# EasyEDA Pro project Luthers-VCO.eprj

# Board Top
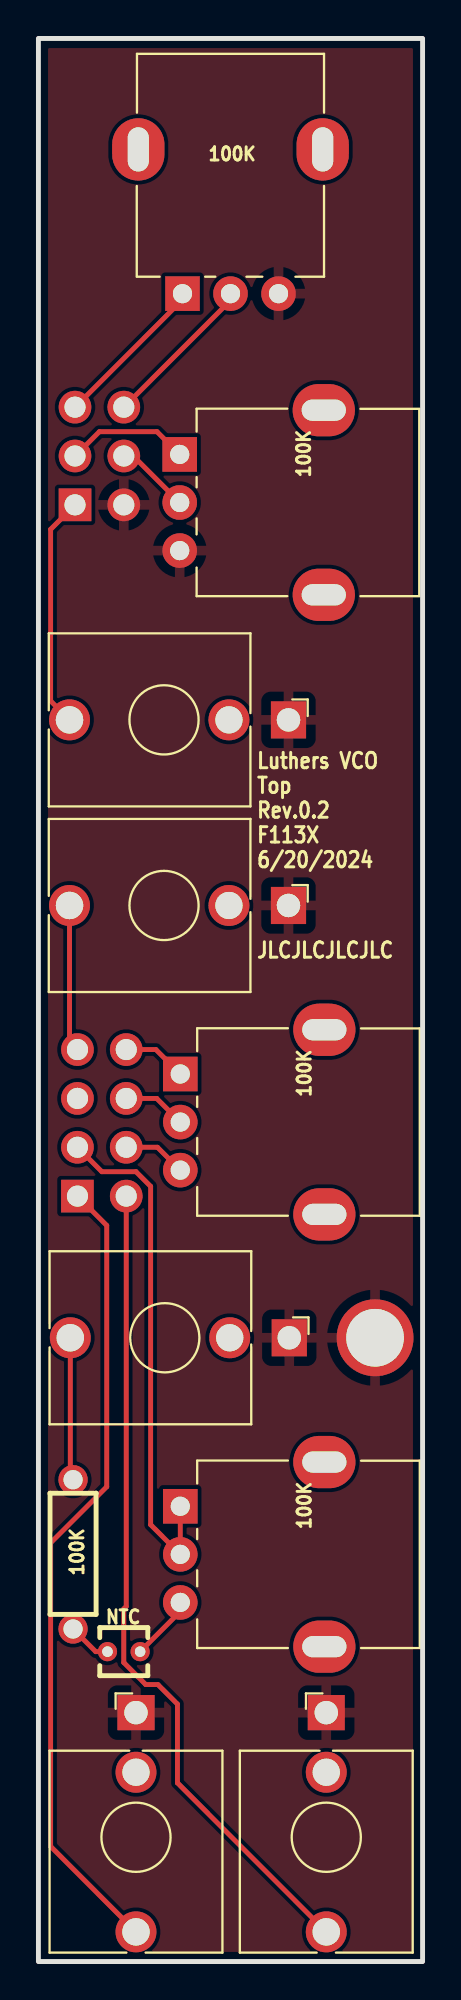
[diagram p0: board, top side]
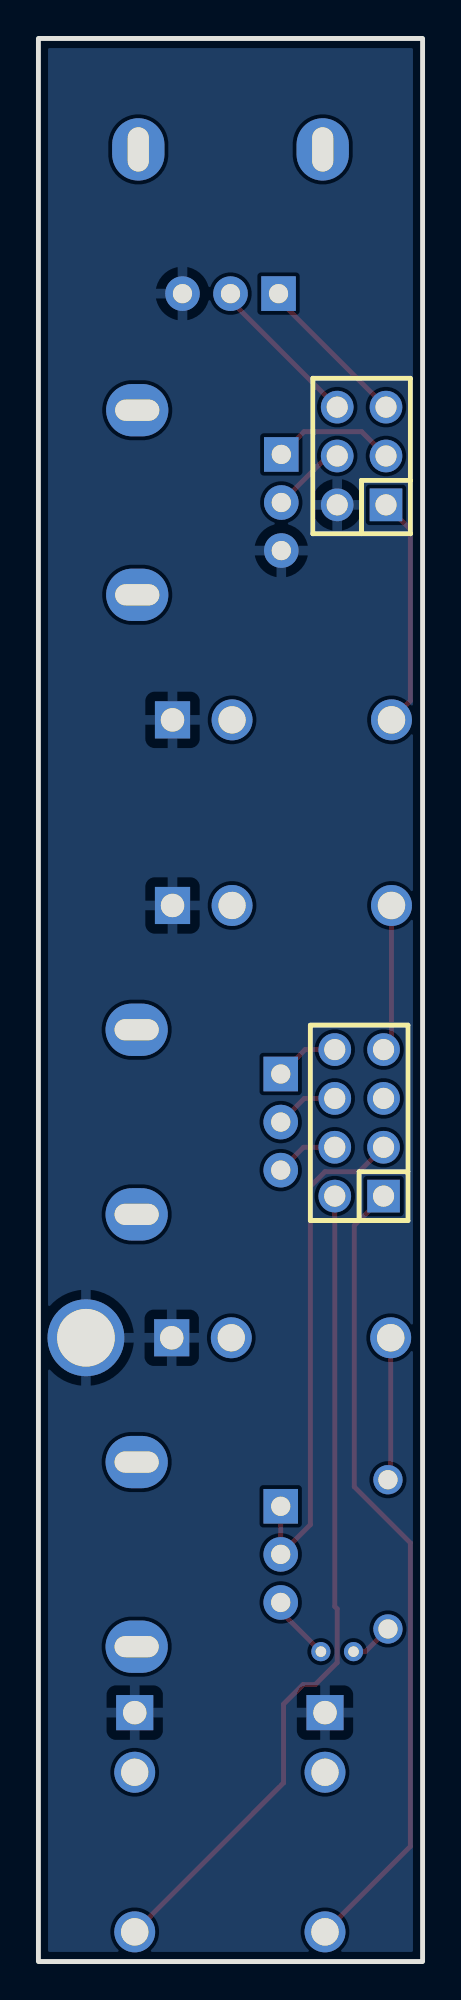
[diagram p1: board, bottom side, seen from below]

Outline 20 x 100 mm; copper layers: Top Layer, Bottom Layer. Coordinates in mm from the lower left corner of the outline.
Outline path: rectangle 0,100 20,0
Stack: Top Layer 0.035mm / Dielectric1 1.51mm FR4 er 4.5 / Bottom Layer 0.035mm

## Design rules (mm)
template: JLCPCB Capability(Two Layers Board)
spacing copperThickness1oz (default): track to track 0.102, other pairs 0.152 to 0.3
spacing copperThickness2oz: track to track 0.203, other pairs 0.152 to 0.3
track width copperThickness1oz (default): min 0.127, default 0.254, max 2.54
track width copperThickness2oz: min 0.203, default 0.254, max 2.54
differential pair differentialPair (default): width min 0.127, default 0.254, max 2.54; gap min 0.152, default 0.152
via viaSize (default): diameter min 0.5, default 0.61, max 10; hole min 0.3, default 0.305, max 6.3

## Placement (name value [footprint] x y rotation side)
100K  -  [Resistor_Small]  1.8 21.17 90 top
100K#2  -  [benjiaomodular:Potentiometer_RV09]  7.36 78.37 0 top
100K#3  -  [benjiaomodular:Potentiometer_RV09]  7.39 23.67 0 top
100K#4  -  [benjiaomodular:Potentiometer_RV09]  7.39 46.15 0 top
100K#5  -  [benjiaomodular:Potentiometer_RV09]  7.5 86.73 90 top
H1  PZ254V-12-6P  [HDR-TH_6P-P2.54-V-M-R2-C3-S2.54]  3.18 78.29 90 bottom
J4  -  [benjiaomodular:AudioJack_3.5mm]  13.02 64.57 270 top
J4#2  -  [benjiaomodular:AudioJack_3.5mm]  5.08 12.94 0 top
J4#3  -  [benjiaomodular:AudioJack_3.5mm]  14.99 12.94 0 top
J4#4  -  [benjiaomodular:AudioJack_3.5mm]  13.06 32.44 270 top
J4#5  -  [benjiaomodular:AudioJack_3.5mm]  13.02 54.92 270 top
NOREF  -  [Pad_e2]  17.53 32.44 0 top
NTC  MF52A103F3950 (A1)  [RES-TH_L2.5-W2.5-P1.70-D0.3]  4.44 16.12 0 top
U2  PZ2.54-2*4  [HDR-TH_8P-P2.54-V-M-R2-C4-S2.54]  3.3 43.61 90 bottom

## Footprints (pads in the part's own frame, mm; a bottom-side part is the same pattern mirrored in y, then rotated)
benjiaomodular:AudioJack_3.5mm
  rect 1.93x1.83 hole 1.22: S(0,0)
  round 2.13 hole 1.43: T(0,-11.4)
  round 2.13 hole 1.42: TN(0,-3.1)
benjiaomodular:Potentiometer_RV09
  rect 1.8x1.8 hole 1: 1(0,0)
  round 1.8 hole 1: 2(0,-2.5) 3(0,-5)
  oval 3.24x2.72 hole 2.3x1.1: 4(7.5,-7.3) 5(7.5,2.3)
HDR-TH_6P-P2.54-V-M-R2-C3-S2.54
  rect 1.7x1.7 hole 1.1: 1(-2.54,-1.27)
  round 1.7 hole 1.1: 2(-2.54,1.27) 3(0,-1.27) 4(0,1.27) 5(2.54,-1.27) 6(2.54,1.27)
HDR-TH_8P-P2.54-V-M-R2-C4-S2.54
  rect 1.7x1.7 hole 1.1: 1(-3.81,-1.27)
  round 1.7 hole 1.1: 2(-3.81,1.27) 3(-1.27,-1.27) 4(-1.27,1.27) 5(1.27,-1.27) 6(1.27,1.27) 7(3.81,-1.27) 8(3.81,1.27)
Pad_e2
  round 4 hole 3: 9(0,0)
RES-TH_L2.5-W2.5-P1.70-D0.3
  round 1 hole 0.55: 1(-0.85,0) 2(0.85,0)
Resistor_Small
  round 1.524 hole 1: 1(-3.88,0) 2(3.882,0)

## Nets
GND: 100K#2.3 100K#5.3 H1.2 J4.S J4#2.S J4#3.S J4#4.S J4#5.S NOREF.9
COARSE_-12: 100K#5.1 H1.5
COARSE_MID: 100K#5.2 H1.6
CV_JACK: H1.1 J4.T
CV_POT: 100K#3.1 100K#3.2 U2.3
FINE_-12: 100K#2.1 H1.3
FINE_MID: 100K#2.2 H1.4
FM_CV: 100K.2 J4#4.T
FM_CV_RES: 100K.1 NTC.1
FM_CV_THERM: 100K#3.3 NTC.2
PULSE_OUT: J4#3.T U2.2
PWM_+12: 100K#4.1 U2.8
PWM_-12: 100K#4.3 U2.4
PWM_CV: J4#5.T U2.7
PWM_POT: 100K#4.2 U2.6
SAW_OUT: J4#2.T U2.1

Pads without a net: 100K#2 4 5; 100K#3 4 5; 100K#4 4 5; 100K#5 4 5; J4 TN; J4#2 TN; J4#3 TN; J4#4 TN; J4#5 TN; U2 5

## Routing (per net, layer and track width the routed paths; a pad name or vN(x,y) marks a point on that pad's centre or on a via; arc(x,y) is an arc through that point)
COARSE_-12: length 8.2
  Top Layer w0.254: 1.91,80.82 7.5,86.42 100K#5.1
COARSE_MID: length 8.2
  Top Layer w0.254: 100K#5.2 10,86.38 4.44,80.82
CV_JACK: length 12.1
  Top Layer w0.254: J4.T 0.63,65.55 0.63,74.47 1.91,75.74
CV_POT: length 26.6
  Top Layer w0.254: 7.39,23.32 100K#3.2 5.84,22.72 5.84,40.31 5.08,41.07 3.3,41.07 U2.3
FINE_-12: length 6.5
  Top Layer w0.254: 100K#2.1 6.17,79.55 3.18,79.55 1.91,78.28
FINE_MID: length 3.9
  Top Layer w0.254: 100K#2.2 4.94,78.28 4.44,78.28
FM_CV: length 7.4
  Top Layer w0.254: 100K.2 1.66,25.2 J4#4.T
FM_CV_RES: length 2.3
  Top Layer w0.254: 100K.1 2.98,16.12 NTC.1
FM_CV_THERM: length 3.4
  Top Layer w0.254: 100K#3.3 7.39,18.21 NTC.2
PULSE_OUT: length 43
  Top Layer w0.254: J4#3.T 7.24,9.29 7.24,13.39 6.22,14.4 5.59,14.4 4.44,15.54 4.44,18.34 4.57,18.47 U2.2
PWM_+12: length 3.3
  Top Layer w0.254: U2.8 6.12,47.42 100K#4.1
PWM_-12: length 3.3
  Top Layer w0.254: U2.4 6.2,42.34 100K#4.3
PWM_CV: length 7.7
  Top Layer w0.254: U2.7 1.62,47.83 J4#5.T
PWM_POT: length 3.3
  Top Layer w0.254: U2.6 6.16,44.88 100K#4.2
SAW_OUT: length 41.9
  Top Layer w0.254: U2.1 3.56,38.28 3.56,24.69 0.63,21.77 0.63,5.99 J4#2.T

## Copper pours and planes (outline as drawn; the poured copper is in the pictures)
GND on Top Layer: 0,100 20,100 20,0 0,0
GND on Bottom Layer: 0,100 20,100 20,0 0,0

## Text on the board
Top Silkscreen Layer: Luthers VCO / Top / Rev.0.2 / F113X / 6/20/2024 | JLCJLCJLCJLC

# Board Bottom
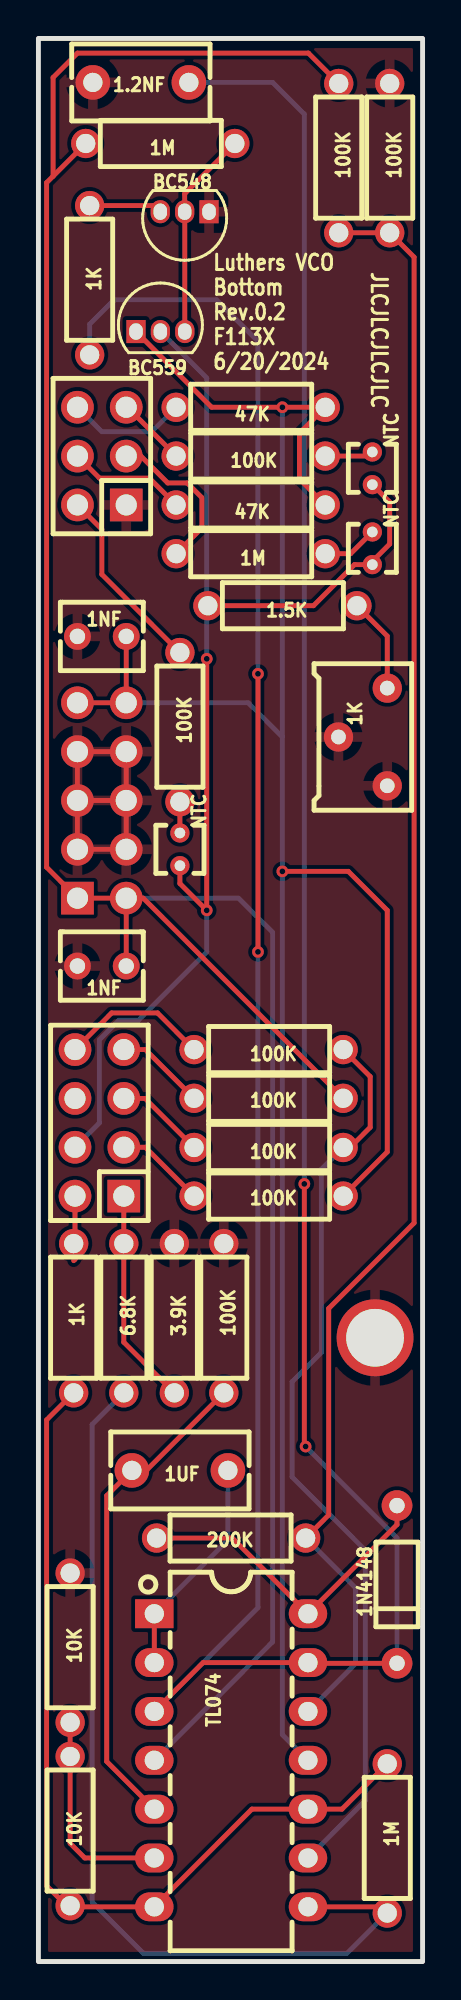
[diagram p2: board, top side]
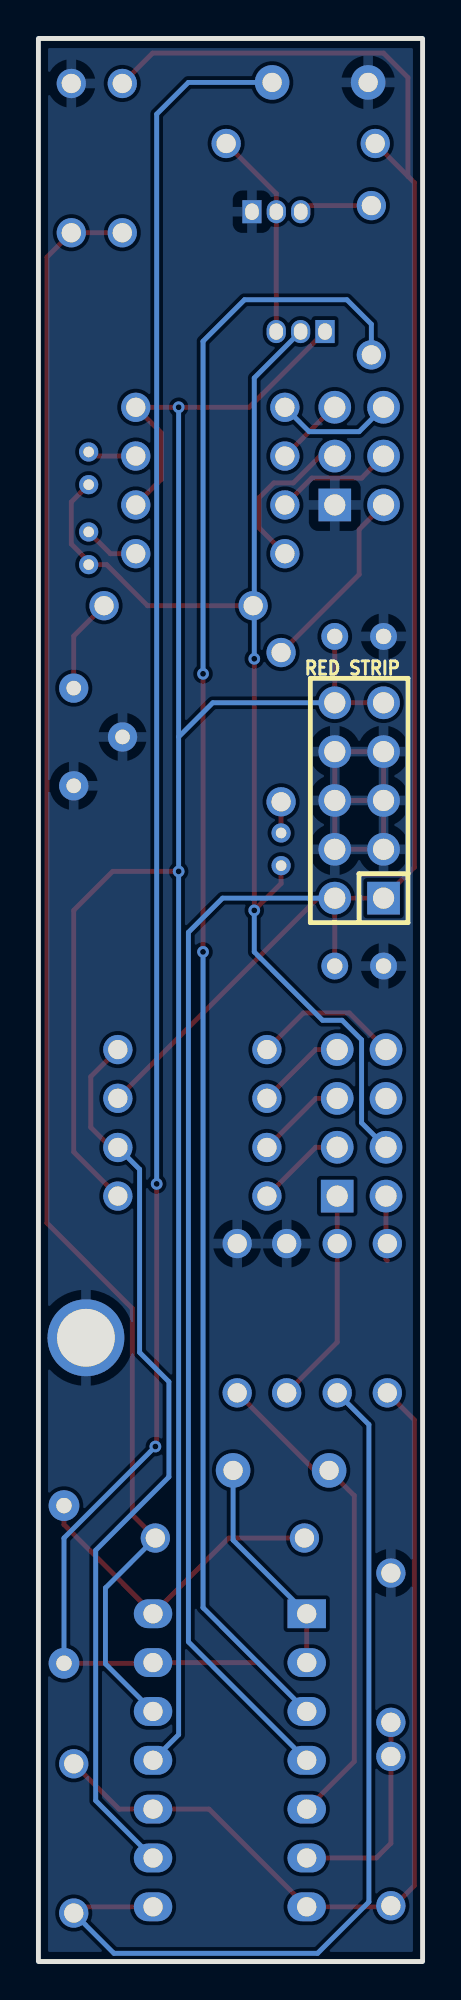
[diagram p3: board, bottom side, seen from below]

Outline 20 x 100 mm; copper layers: Top Layer, Bottom Layer. Coordinates in mm from the lower left corner of the outline.
Outline path: rectangle 0,100 20,0
Stack: Top Layer 0.035mm / Dielectric1 1.51mm FR4 er 4.5 / Bottom Layer 0.035mm

## Design rules (mm)
template: JLCPCB Capability(Two Layers Board)
spacing copperThickness1oz (default): track to track 0.102, other pairs 0.152 to 0.3
spacing copperThickness2oz: track to track 0.203, other pairs 0.152 to 0.3
track width copperThickness1oz (default): min 0.127, default 0.254, max 2.54
track width copperThickness2oz: min 0.203, default 0.254, max 2.54
differential pair differentialPair (default): width min 0.127, default 0.254, max 2.54; gap min 0.152, default 0.152
via viaSize (default): diameter min 0.5, default 0.61, max 10; hole min 0.3, default 0.305, max 6.3

## Placement (name value [footprint] x y rotation side)
1.2NF  47nF  [CAP-TH_L7.2-W4.0-P5.00-D0.5]  5.33 97.71 0 top
1.5K  -  [Resistor_Small]  12.7 70.5 0 top
1K  -  [RES-ADJ-TH_3362S]  16.89 63.68 270 top
1K#2  -  [Resistor_Small]  2.67 87.43 90 top
1K#3  -  [Resistor_Small]  1.84 33.45 90 top
1M  -  [Resistor_Small]  6.34 94.54 0 top
1M#2  -  [Resistor_Small]  11.05 73.21 0 top
1M#3  -  [Resistor_Small]  18.16 6.4 90 top
1N4148  1N4148  [DO-35_BD2.0-L4.2-P8.20-D0.5-RD]  18.67 19.61 90 top
1NF  -  [CAP-TH_L4.2-W3.5-P2.54-D0.5]  3.3 51.77 0 top
1NF#2  -  [CAP-TH_L4.2-W3.5-P2.54-D0.5]  3.3 68.91 0 top
1UF  47nF  [CAP-TH_L7.2-W4.0-P5.00-D0.5]  7.37 25.54 0 top
3.9K  -  [Resistor_Small]  7.08 33.45 90 top
6.8K  -  [Resistor_Small]  4.44 33.45 90 top
10K  -  [Resistor_Small]  1.65 6.78 90 top
10K#2  -  [Resistor_Small]  1.65 16.32 90 top
47K  -  [Resistor_Small]  11.05 80.82 0 top
47K#2  -  [Resistor_Small]  11.05 75.74 0 top
100K  -  [Resistor_Small]  9.65 33.45 90 top
100K#2  -  [Resistor_Small]  15.63 93.78 90 top
100K#3  -  [Resistor_Small]  11.05 78.29 0 top
100K#4  -  [Resistor_Small]  7.37 64.19 90 top
100K#5  -  [Resistor_Small]  18.29 93.78 90 top
100K#6  -  [Resistor_Small]  11.98 47.42 0 top
100K#7  -  [Resistor_Small]  11.98 44.89 0 top
100K#8  -  [Resistor_Small]  11.98 42.33 0 top
100K#9  -  [Resistor_Small]  11.98 39.8 0 top
200K  -  [Resistor_Small]  10.03 22.02 180 top
BC548  BC558  [TO-92-3_L4.5-W3.5-P1.27-L]  7.61 90.99 180 top
BC559  BC558  [TO-92-3_L4.5-W3.5-P1.27-L]  6.35 84.76 0 top
H1  PZ254V-12-6P  [HDR-TH_6P-P2.54-V-M-R2-C3-S2.54]  3.3 78.28 90 top
NOREF  -  [Pad_e4]  17.53 32.44 0 top
NTC  -  [RES-TH_L2.5-W2.5-P1.70-D0.3]  17.38 77.65 270 top
NTC#2  -  [RES-TH_L2.5-W2.5-P1.70-D0.3]  17.38 73.49 270 top
NTC#3  -  [RES-TH_L2.5-W2.5-P1.70-D0.3]  7.37 57.84 270 top
RED STRIP  ZX-PZ2.54-2-5PZZ  [HDR-TH_10P-P2.54-V-M-R2-C5-S2.54]  3.3 60.38 90 bottom
TL074  TL074CN  [PDIP-14_L19.7-W6.6-P2.54-LS8.3-BL]  10.03 10.47 270 top
U2  PZ2.54-2*4  [HDR-TH_8P-P2.54-V-M-R2-C4-S2.54]  3.18 43.61 90 top

## Footprints (pads in the part's own frame, mm; a bottom-side part is the same pattern mirrored in y, then rotated)
CAP-TH_L4.2-W3.5-P2.54-D0.5
  round 1.4 hole 0.8: 1(-1.27,0) 2(1.27,0)
CAP-TH_L7.2-W4.0-P5.00-D0.5
  round 1.8 hole 1: 1(-2.499,0) 2(2.499,0)
DO-35_BD2.0-L4.2-P8.20-D0.5-RD
  round 1.6 hole 0.8: 1(-4.1,0) 2(4.1,0)
HDR-TH_6P-P2.54-V-M-R2-C3-S2.54
  rect 1.7x1.7 hole 1.1: 1(-2.54,-1.27)
  round 1.7 hole 1.1: 2(-2.54,1.27) 3(0,-1.27) 4(0,1.27) 5(2.54,-1.27) 6(2.54,1.27)
HDR-TH_8P-P2.54-V-M-R2-C4-S2.54
  rect 1.7x1.7 hole 1.1: 1(-3.81,-1.27)
  round 1.7 hole 1.1: 2(-3.81,1.27) 3(-1.27,-1.27) 4(-1.27,1.27) 5(1.27,-1.27) 6(1.27,1.27) 7(3.81,-1.27) 8(3.81,1.27)
HDR-TH_10P-P2.54-V-M-R2-C5-S2.54
  rect 1.7x1.7 hole 1.1: 1(-5.08,-1.27)
  round 1.7 hole 1.1: 2(-5.08,1.27) 3(-2.54,-1.27) 4(-2.54,1.27) 5(0,-1.27) 6(0,1.27) 7(2.54,-1.27) 8(2.54,1.27) 9(5.08,-1.27) 10(5.08,1.27)
Pad_e4
  round 4 hole 3: 15(0,0)
PDIP-14_L19.7-W6.6-P2.54-LS8.3-BL
  rect 1.5x2 hole 1: 1(-7.62,-4)
  oval 1.5x2 hole 1: 2(-5.08,-4) 3(-2.54,-4) 4(0,-4) 5(2.54,-4) 6(5.08,-4) 7(7.62,-4) 8(7.62,4) 9(5.08,4) 10(2.54,4) 11(0,4) 12(-2.54,4) 13(-5.08,4) 14(-7.62,4)
RES-ADJ-TH_3362S
  round 1.524 hole 0.762: 1(2.54,1.27) 2(0,-1.27) 3(-2.54,1.27)
RES-TH_L2.5-W2.5-P1.70-D0.3
  round 1 hole 0.55: 1(-0.85,0) 2(0.85,0)
Resistor_Small
  round 1.524 hole 1: 1(-3.88,0) 2(3.882,0)
TO-92-3_L4.5-W3.5-P1.27-L
  rect 1x1.2 hole 0.7x0.85: 1(-1.27,0)
  oval 1x1.2 hole 0.7x0.85: 2(0,0) 3(1.27,0)

## Nets
GND: 1.2NF.1 1K.1 1K.2 1NF.1 1NF#2.1 3.9K.2 10K#2.2 100K.2 100K#5.2 BC548.1 H1.1 NOREF.15 RED STRIP.3 RED STRIP.4 RED STRIP.5 RED STRIP.6 RED STRIP.7 RED STRIP.8
+12: 1M.1 1NF.2 100K#2.2 100K#7.2 RED STRIP.1 RED STRIP.2 TL074.4
-12: 1NF#2.2 47K.2 47K#2.2 100K#9.2 BC559.1 RED STRIP.9 RED STRIP.10 TL074.11
A: 100K#2.1 100K#5.1 200K.1 TL074.12
COARSE_-12: 47K.1 H1.6
COARSE_MID: 100K#3.1 H1.5
CV_JACK: 100K#4.2 H1.2
CV_POT: 1.5K.1 BC559.2 NTC.2 NTC#2.2 NTC#3.2 U2.4
FINE_-12: 47K#2.1 H1.4
FINE_MID: 1M#2.1 H1.3
PULSE_OUT: 3.9K.1 6.8K.2 U2.1
PWM_+12: 100K#7.1 U2.7
PWM_-12: 100K#9.1 U2.3
PWM_CV: 100K#6.1 U2.8
PWM_POT: 100K#8.1 U2.5
SAW_OUT: 1K#3.2 U2.2

Pads without a net: 1.2NF 2; 1.5K 2; 1K 3; 1K#2 1 2; 1K#3 1; 1M 2; 1M#2 2; 1M#3 1 2; 1N4148 1 2; 1UF 1 2; 6.8K 1; 10K 1 2; 10K#2 1; 100K 1; 100K#3 2; 100K#4 1; 100K#6 2; 100K#8 2; 200K 2; BC548 2 3; BC559 3; NTC 1; NTC#2 1; NTC#3 1; TL074 1 2 3 5 6 7 8 9 10 13 14; U2 6

## Via types
v1: diameter 0.61, hole 0.305, Top Layer to Bottom Layer, 8 vias

## Routing (per net, layer and track width the routed paths; a pad name or vN(x,y) marks a point on that pad's centre or on a via; arc(x,y) is an arc through that point)
GND: length 17.8
  Top Layer w0.254: RED STRIP.6 RED STRIP.8 RED STRIP.7 RED STRIP.5 ; RED STRIP.6 RED STRIP.4 RED STRIP.3 RED STRIP.5 ; RED STRIP.6 RED STRIP.5
(no net): length 423.7
  Top Layer w0.254: 1M#3.1 17.84,2.84 TL074.8 ; 100K#6.2 17.27,46.02 17.27,43.38 16.22,42.33 100K#8.2 ; v1(11.43,52.5) v1(11.43,66.96) ; BC559.3 7.62,90.98 BC548.2 7.61,91.93 1M.2 ; TL074.5 3.56,10.4 3.56,24.23 1UF.1 5.62,25.54 100K.1 ; 100K#3.2 17.17,78.29 NTC.1 ; 10K.1 1.71,2.84 TL074.7 11.11,7.93 TL074.10 15.8,7.93 1M#3.2 ; 10K#2.1 10K.2 1.65,6.15 2.41,5.38 TL074.6 ; NTC#3.1 100K#4.1 ; v1(13.91,26.78) 13.84,26.85 v1(13.84,40.44) ; TL074.3 8.57,15.54 14.03,15.54 14.07,15.51 1N4148.1 ; 1.52,2.84 0.43,3.94 0.43,28.16 1K#3.1 ; TL074.1 6.03,15.54 ; 1K.3 18.16,68.92 1.5K.2 ; 1K#2.2 6.03,91.31 BC548.3 ; 1M#2.2 16.25,73.21 NTC#2.1 ; 200K.2 10.1,22.02 TL074.14 18.67,22.72 1N4148.2
  Bottom Layer w0.254: TL074.9 17.02,8.37 17.02,21.39 13.21,25.2 13.21,30.15 14.73,31.67 14.73,41.2 100K#8.2 ; v1(11.43,52.5) 11.43,18.4 TL074.3 ; v1(13.84,40.44) 13.84,96.06 12.19,97.71 1.2NF.2 ; v1(13.91,26.78) 18.67,22.02 1N4148.1 ; 7.11,97.71 7.09,97.73 ; 1K#2.1 2.67,85.14 3.94,86.41 9.27,86.41 11.43,84.25 v1(11.43,66.96) ; 1M#3.1 16.07,0.43 5.47,0.43 2.79,3.1 2.79,27.92 6.8K.1 ; 1UF.2 9.87,21.92 TL074.1
+12: length 137.6
  Top Layer w0.254: 1NF.2 RED STRIP.2 ; RED STRIP.2 RED STRIP.1 0.43,56.9 0.43,92.5 0.76,92.84 ; RED STRIP.2 5.46,55.3 100K#7.2 ; 0.76,92.84 0.76,97.97 2.03,99.24 14.06,99.24 100K#2.2 ; 0.76,92.84 1M.1
  Bottom Layer w0.254: RED STRIP.2 10.41,55.3 12.19,53.52 12.19,16.62 TL074.4
-12: length 125.5
  Top Layer w0.254: RED STRIP.9 RED STRIP.10 1NF#2.2 ; 47K#2.2 13.59,77.08 13.59,79.48 47K.2 14.93,80.82 v1(12.7,80.82) 9.02,80.82 BC559.1 ; 100K#9.2 18.16,42.1 18.16,54.66 16.13,56.69 v1(12.7,56.69)
  Bottom Layer w0.254: RED STRIP.10 10.92,65.46 12.7,63.68 ; v1(12.7,80.82) 12.7,63.68 ; 12.7,63.68 v1(12.7,56.69) 12.7,11.8 TL074.11
A: length 84.5
  Top Layer w0.254: 200K.1 15.11,23.22 15.11,33.96 19.56,38.41 19.56,88.63 100K#5.1 100K#2.1
  Bottom Layer w0.254: 200K.1 16.51,19.42 16.51,15.48 TL074.12
COARSE_-12: length 6.2
  Bottom Layer w0.254: H1.6 3.3,79.55 5.9,79.55 47K.1
COARSE_MID: length 3.6
  Top Layer w0.254: 100K#3.1 4.63,80.82 H1.5
CV_JACK: length 9.9
  Top Layer w0.254: 100K#4.2 3.3,72.13 3.3,74.47 H1.2
CV_POT: length 64.1
  Top Layer w0.254: NTC.2 18.29,75.89 18.29,73.71 17.38,72.81 NTC#2.2 16.45,72.64 14.32,70.5 1.5K.1 ; v1(8.76,67.74) v1(8.76,54.66) 7.37,56.06 NTC#3.2
  Bottom Layer w0.254: v1(8.76,54.66) 8.76,52.5 5.21,48.95 4.19,48.95 3.18,47.93 3.18,43.61 U2.4 ; BC559.2 8.76,82.35 v1(8.76,67.74)
FINE_-12: length 6.2
  Top Layer w0.254: 47K#2.1 5.77,77.14 3.18,77.14 H1.4
FINE_MID: length 8.3
  Top Layer w0.254: 1M#2.1 8.51,74.55 8.51,76.12 7.75,76.89 6.73,76.89 5.33,78.28 H1.3
PULSE_OUT: length 11.3
  Top Layer w0.254: 3.9K.1 4.44,32.2 6.8K.2 4.44,39.8
PWM_+12: length 4.7
  Top Layer w0.254: 100K#7.1 5.57,47.42 4.44,47.42
PWM_-12: length 4.7
  Top Layer w0.254: 4.44,42.34 5.57,42.34 100K#9.1
PWM_CV: length 7.8
  Top Layer w0.254: 100K#6.1 6.2,49.33 3.81,49.33 U2.8
PWM_POT: length 4.7
  Top Layer w0.254: 100K#8.1 5.55,44.88 4.44,44.88
SAW_OUT: length 3.4
  Top Layer w0.254: U2.2 1.91,36.52 1.84,36.45

## Copper pours and planes (outline as drawn; the poured copper is in the pictures)
GND on Top Layer: 0,100 20,100 20,0 0,0
GND on Bottom Layer: 0,100 20,100 20,0 0,0

## Text on the board
Top Silkscreen Layer: Luthers VCO / Bottom / Rev.0.2 / F113X / 6/20/2024 | JLCJLCJLCJLC

# Board Panel
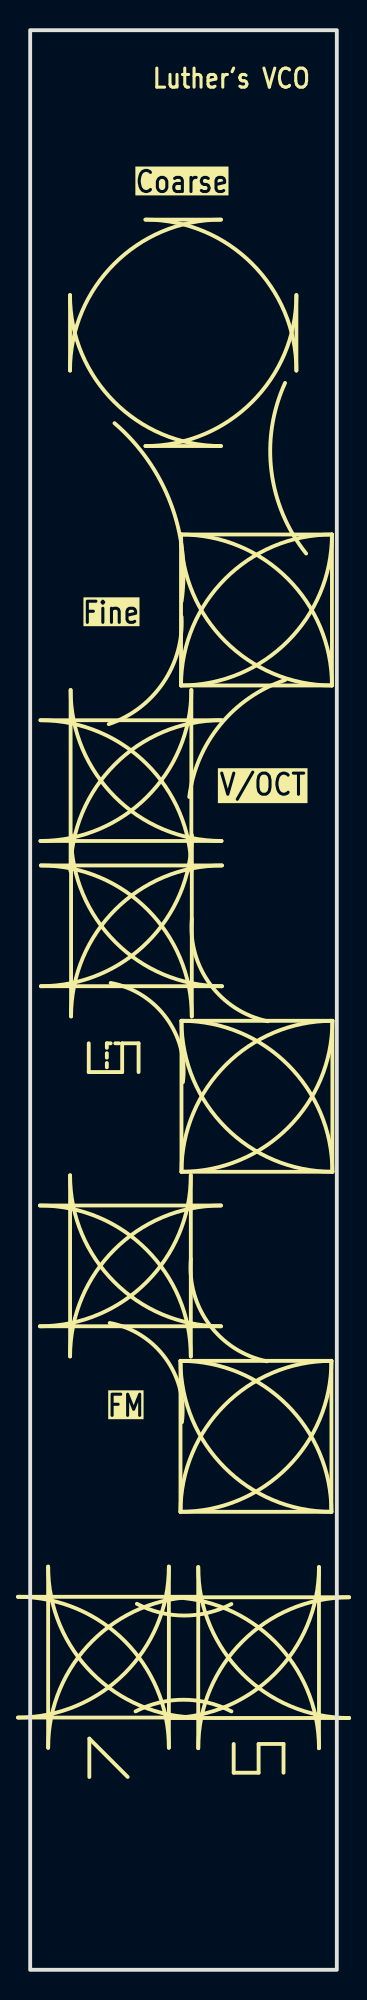
[diagram p4: board, top side]
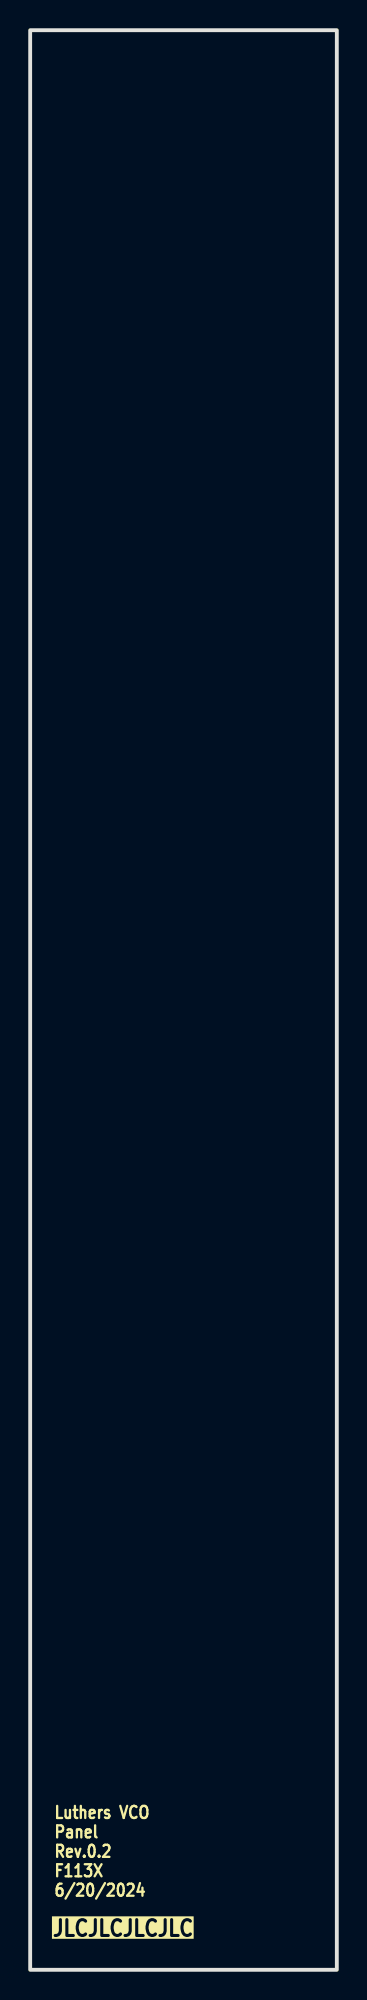
[diagram p5: board, bottom side, seen from below]

Outline 20.32 x 128.5 mm; copper layers: Top Layer, Bottom Layer. Coordinates in mm from the lower left corner of the outline.
Outline path: rectangle 0,128.5 20.32,0
Stack: Top Layer 0.035mm / Dielectric1 1.51mm FR4 er 4.5 / Bottom Layer 0.035mm

## Design rules (mm)
template: JLCPCB Capability(Two Layers Board)
spacing copperThickness1oz (default): track to track 0.102, other pairs 0.152 to 0.3
spacing copperThickness2oz: track to track 0.203, other pairs 0.152 to 0.3
track width copperThickness1oz (default): min 0.127, default 0.254, max 2.54
track width copperThickness2oz: min 0.203, default 0.254, max 2.54
differential pair differentialPair (default): width min 0.127, default 0.254, max 2.54; gap min 0.152, default 0.152
via viaSize (default): diameter min 0.5, default 0.61, max 10; hole min 0.3, default 0.305, max 6.3

## Placement (name value [footprint] x y rotation side)

## Nets

## Text on the board
Bottom Silkscreen Layer: Luthers VCO / Panel / Rev.0.2 / F113X / 6/20/2024 | JLCJLCJLCJLC
Top Silkscreen Layer: Luther's VCO | Fine | FM | Coarse | V/OCT
